# EAGLE design sch (EAGLE 9.5.0)
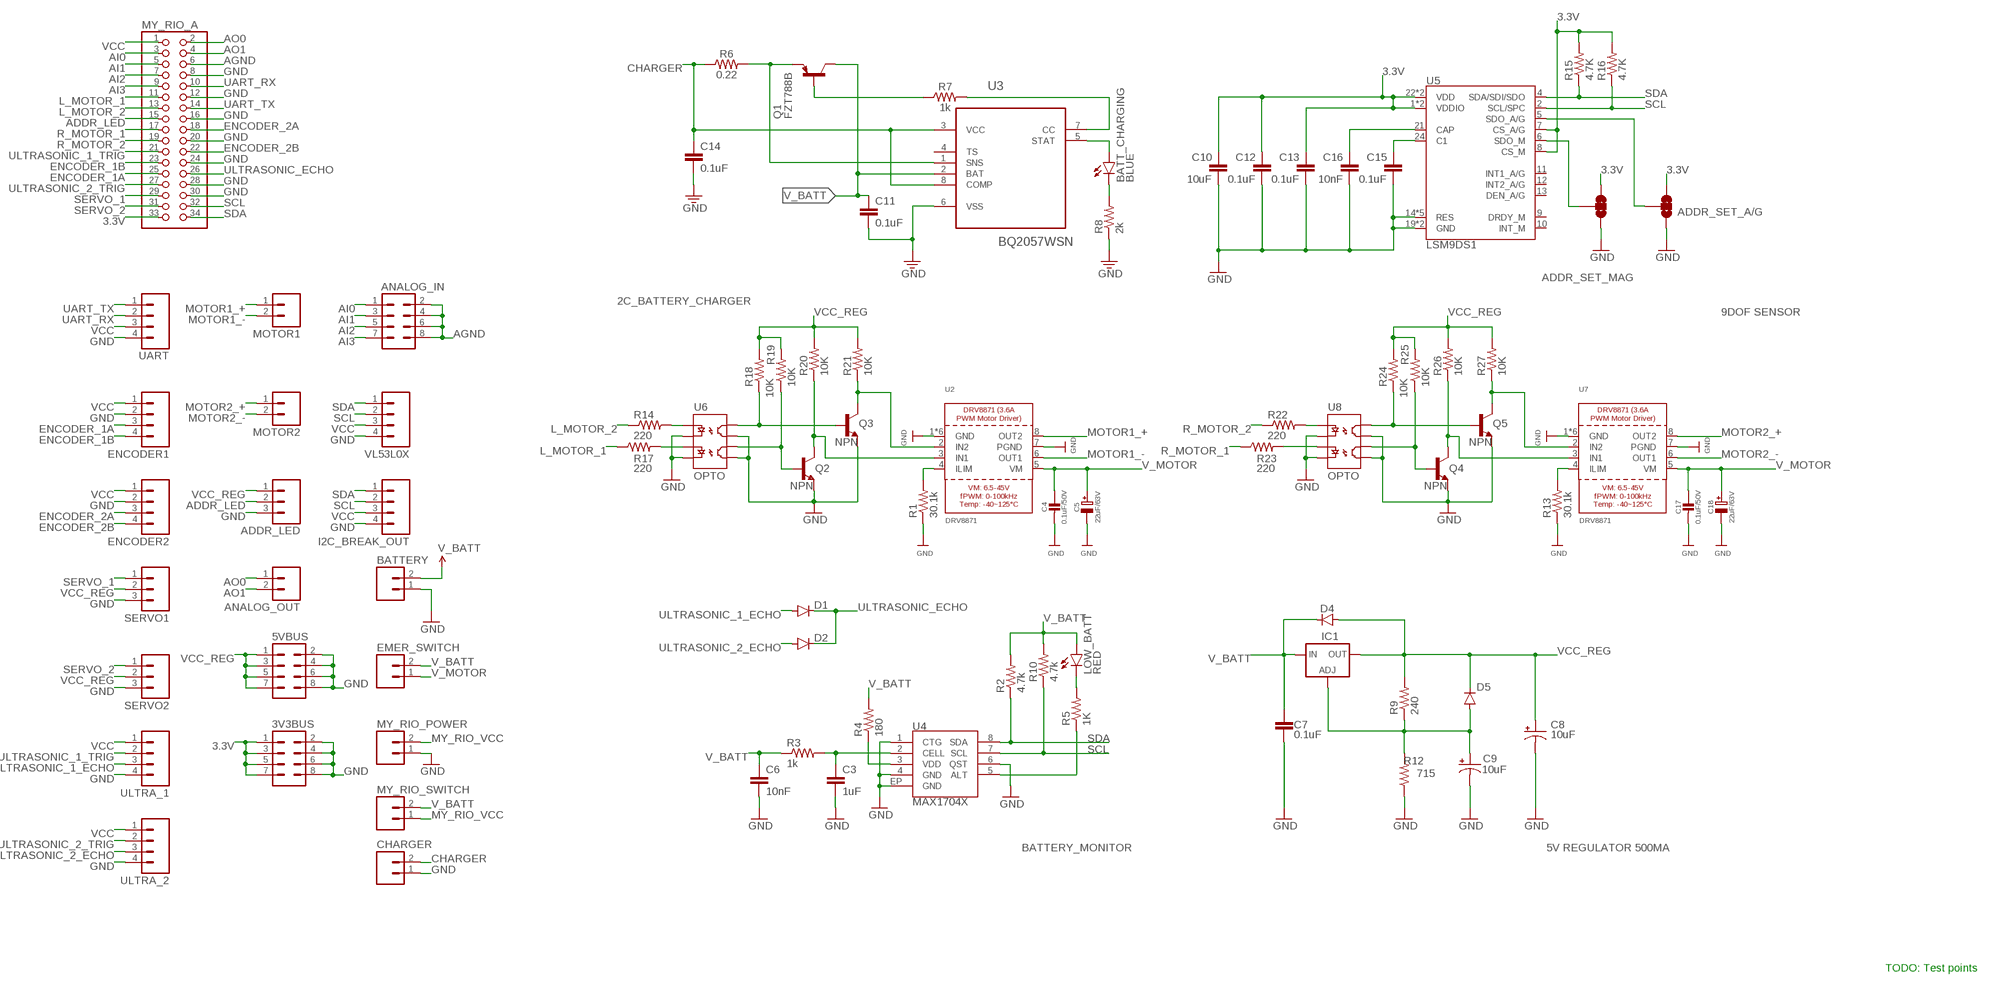
[diagram p0: schematic, sheet 1]

## Parts
3V3BUS  M04X2  [2X4]
5VBUS  M04X2  [2X4]
ADDR_LED  M03POLAR  [MOLEX-1X3]
ADDR_SET_A/G  JUMPER-PAD-3-2OF3_NC_BY_TRACE_SMALL  [PAD-JUMPER-3-2OF3_NC_BY_TRACE_YES_SILK_FULL_BOX]
ADDR_SET_MAG  JUMPER-PAD-3-2OF3_NC_BY_TRACE_SMALL  [PAD-JUMPER-3-2OF3_NC_BY_TRACE_YES_SILK_FULL_BOX]
ANALOG_IN  M04X2  [2X4]
ANALOG_OUT  M021X02_NO_SILK  [1X02_NO_SILK@1]
BATT_CHARGING  BLUE  LED-BLUE0603  [LED-0603]
BATTERY  CONN_02  [1X02]
C3  1uF  CAP0402-CAP  [0402-CAP]
C4  0.1uF/50V  CAP_CERAMIC0805-NOOUTLINE  [0805-NO]
C5  22uF/63V  CAP_ELECTROLYTICPANASONIC_D  [PANASONIC_D]
C6  10nF  CAP0402-CAP  [0402-CAP]
C7  0.1uF  0.1UF-25V(+80/-20%)(0603)  [0603-CAP]
C8  10uF  10UF-16V-10%(TANT)  [EIA3216]
C9  10uF  10UF-16V-10%(TANT)  [EIA3216]
C10  10uF  10UF-6.3V-20%(0603)  [0603-CAP]
C11  0.1uF  0.1UF-0603-25V-(+80/-20%)  [0603]
C12  0.1uF  0.1UF-25V(+80/-20%)(0603)  [0603-CAP]
C13  0.1uF  0.1UF-25V(+80/-20%)(0603)  [0603-CAP]
C14  0.1uF  0.1UF-0603-25V-(+80/-20%)  [0603]
C15  0.1uF  0.1UF-25V(+80/-20%)(0603)  [0603-CAP]
C16  10nF  10NF/10000PF-50V-10%(0603)  [0603-CAP]
C17  0.1uF/50V  CAP_CERAMIC0805-NOOUTLINE  [0805-NO]
C18  22uF/63V  CAP_ELECTROLYTICPANASONIC_D  [PANASONIC_D]
CHARGER  CONN_02  [1X02]
D1  DIODESOD123  [SOD-123]
D2  DIODESOD123  [SOD-123]
D4  1N4002  DIODESOD123  [SOD-123]
D5  1N4002  DIODESOD123  [SOD-123]
EMER_SWITCH  CONN_02  [1X02]
ENCODER1  M041X04_NO_SILK  [1X04_NO_SILK]
ENCODER2  M041X04_NO_SILK  [1X04_NO_SILK]
I2C_BREAK_OUT  M041X04_NO_SILK  [1X04_NO_SILK]
IC1  LM317MBSTT3  [SOT223]
LOW_BATT  RED  LED-RED0603  [LED-0603]
MOTOR1  M02PTH  [1X02@1]
MOTOR2  M02PTH  [1X02@1]
MY_RIO_A  PINHD-2X17  [2X17]
MY_RIO_POWER  CONN_02  [1X02]
MY_RIO_SWITCH  CONN_02  [1X02]
Q1  FZT788B  [SOT230P700X180-4N]
Q2  NPN  TRANSISTOR_NPNSOT23-3  [SOT23-3]
Q3  NPN  TRANSISTOR_NPNSOT23-3  [SOT23-3]
Q4  NPN  TRANSISTOR_NPNSOT23-3  [SOT23-3]
Q5  NPN  TRANSISTOR_NPNSOT23-3  [SOT23-3]
R1  30.1k  30.1KOHM1/10W1%(0603)  [0603-RES]
R2  4.7k  RESISTOR0402-RES  [0402-RES]
R3  1k  RESISTOR0402-RES  [0402-RES]
R4  180  RESISTOR0402-RES  [0402-RES]
R5  1K  1KOHM-1/10W-1%(0603)  [0603-RES]
R6  0.22  0.22OHM-0805-1/4W-1%  [0805@1]
R7  1k  1KOHM-0603-1/10W-1%  [0603]
R8  2k  RESISTOR0603  [0603-RES]
R9  240  240OHM1/10W1%(0603)  [0603-RES]
R10  4.7k  RESISTOR0402-RES  [0402-RES]
R12  715  715OHM1/10W1%(0603)  [0603-RES]
R13  30.1k  30.1KOHM1/10W1%(0603)  [0603-RES]
R14  220  220OHM-1/10W-1%(0603)  [0603-RES]
R15  4.7K  4.7KOHM-1/10W-1%(0603)  [0603-RES]
R16  4.7K  4.7KOHM-1/10W-1%(0603)  [0603-RES]
R17  220  220OHM-1/10W-1%(0603)  [0603-RES]
R18  10K  10KOHM-1/10W-1%(0603)0603  [0603-RES]
R19  10K  10KOHM-1/10W-1%(0603)0603  [0603-RES]
R20  10K  10KOHM-1/10W-1%(0603)0603  [0603-RES]
R21  10K  10KOHM-1/10W-1%(0603)0603  [0603-RES]
R22  220  220OHM-1/10W-1%(0603)  [0603-RES]
R23  220  220OHM-1/10W-1%(0603)  [0603-RES]
R24  10K  10KOHM-1/10W-1%(0603)0603  [0603-RES]
R25  10K  10KOHM-1/10W-1%(0603)0603  [0603-RES]
R26  10K  10KOHM-1/10W-1%(0603)0603  [0603-RES]
R27  10K  10KOHM-1/10W-1%(0603)0603  [0603-RES]
SERVO1  M03POLAR  [MOLEX-1X3]
SERVO2  M03POLAR  [MOLEX-1X3]
U2  DRV8871  [HSOP8]
U3  BQ2057WSN  [SOIC127P600X175-8N]
U4  MAX1704X  [TDFN-8]
U5  LSM9DS1  [LGA24-8X4]
U6  OPTO  OPTOISOLATOR-2SOIC8  [SO08-2]
U7  DRV8871  [HSOP8]
U8  OPTO  OPTOISOLATOR-2SOIC8  [SO08-2]
UART  M04NO_SILK_ALL_ROUND  [1X04_NO_SILK_ALL_ROUND]
ULTRA_1  M041X04_NO_SILK  [1X04_NO_SILK]
ULTRA_2  M041X04_NO_SILK  [1X04_NO_SILK]
VL53L0X  M041X04_NO_SILK  [1X04_NO_SILK]

## Nets
3.3V: 3V3BUS.1 3V3BUS.3 3V3BUS.5 3V3BUS.7 ADDR_SET_A/G.3 ADDR_SET_MAG.3 C10.1 C12.1 C13.1 MY_RIO_A.33 R15.2 R16.2 U5.1(VDDIO) U5.3(VDDIO) U5.7(CS_A/G) U5.8(CS_M) U5.22(VDD) U5.23(VDD)
ADDR_LED [Signal]: ADDR_LED.2 MY_RIO_A.15
AGND [Signal]: ANALOG_IN.2 ANALOG_IN.4 ANALOG_IN.6 ANALOG_IN.8 MY_RIO_A.6
AI0 [Signal]: ANALOG_IN.1 MY_RIO_A.3
AI1 [Signal]: ANALOG_IN.3 MY_RIO_A.5
AI2 [Signal]: ANALOG_IN.5 MY_RIO_A.7
AI3 [Signal]: ANALOG_IN.7 MY_RIO_A.9
ALT [Signal]: R5.1 U4.5(ALT)
AO0 [Signal]: ANALOG_OUT.1 MY_RIO_A.2
AO1 [Signal]: ANALOG_OUT.2 MY_RIO_A.4
BATTERY_MONITOR_2 [Signal]: BATT_CHARGING.A U3.5(STAT)
CHARGER [Signal]: C14.1 CHARGER.2 R6.1 U3.3(VCC) U3.8(COMP)
ENCODER_1A [Signal]: ENCODER1.3 MY_RIO_A.25
ENCODER_1B [Signal]: ENCODER1.4 MY_RIO_A.23
ENCODER_2A [Signal]: ENCODER2.3 MY_RIO_A.18
ENCODER_2B [Signal]: ENCODER2.4 MY_RIO_A.22
GND: 3V3BUS.2 3V3BUS.4 3V3BUS.6 3V3BUS.8 5VBUS.2 5VBUS.4 5VBUS.6 5VBUS.8 ADDR_LED.3 ADDR_SET_A/G.1 ADDR_SET_MAG.1 BATTERY.1 C3.2 C4.2 C5.- C6.2 C7.2 C8.C(-) C9.C(-) C10.2 C11.2 C12.2 C13.2 C14.2 C15.2 C16.2 C17.2 C18.- CHARGER.1 ENCODER1.2 ENCODER2.2 I2C_BREAK_OUT.4 MY_RIO_A.8 MY_RIO_A.12 MY_RIO_A.16 MY_RIO_A.20 MY_RIO_A.24 MY_RIO_A.28 MY_RIO_A.30 MY_RIO_POWER.1 Q2.2(E) Q3.2(E) Q4.2(E) Q5.2(E) R1.1 R8.1 R12.1 R13.1 SERVO1.3 SERVO2.3 U2.1(GND) U2.7(PGND) U2.GND U2.P$1(GND) U2.P$2(GND) U2.P$3(GND) U2.P$4(GND) U3.6(VSS) U4.1(CTG) U4.4(GND) U4.6(QST) U4.EP(GND) U5.14(RES) U5.15(RES) U5.16(RES) U5.17(RES) U5.18(RES) U5.19(GND) U5.20(GND) U6.2(C1) U6.4(C2) U6.5(EM2) U6.7(EM1) U7.1(GND) U7.7(PGND) U7.GND U7.P$1(GND) U7.P$2(GND) U7.P$3(GND) U7.P$4(GND) U8.2(C1) U8.4(C2) U8.5(EM2) U8.7(EM1) UART.4 ULTRA_1.4 ULTRA_2.4 VL53L0X.4
L_MOTOR_1 [Signal]: MY_RIO_A.11 R17.1
L_MOTOR_2 [Signal]: MY_RIO_A.13 R14.1
MOTOR1_+ [Power]: MOTOR1.1 U2.8(OUT2)
MOTOR1_- [Power]: MOTOR1.2 U2.6(OUT1)
MOTOR2_+ [Power]: MOTOR2.1 U7.8(OUT2)
MOTOR2_- [Power]: MOTOR2.2 U7.6(OUT1)
MY_RIO_VCC: MY_RIO_POWER.2 MY_RIO_SWITCH.1
N$1: R1.2 U2.4(ILIM)
N$2 [Signal]: R17.2 U6.3(A2)
N$3: C3.1 R3.2 U4.2(CELL)
N$4 [Signal]: R14.2 U6.1(A1)
N$5: LOW_BATT.C R5.2
N$6: C9.A(+) D5.A IC1.1(ADJ) R9.1 R12.2
N$8: R13.2 U7.4(ILIM)
N$9: C16.1 U5.21(CAP)
N$10 [Signal]: C15.1 U5.24(C1)
N$11: R22.2 U8.1(A1)
N$12: R23.2 U8.3(A2)
N$18 [Power]: Q1.3(E) R6.2 U3.1(SNS)
N$19 [Power]: Q1.1(B) R7.1
N$34: R7.2 U3.7(CC)
N$37: BATT_CHARGING.C R8.2
OUT1 [Signal]: Q3.3(C) R21.1 U2.2(IN2)
OUT1N [Signal]: Q3.1(B) R18.1 U6.8(CL1)
OUT1N1: Q5.1(B) R24.1 U8.8(CL1)
OUT2 [Signal]: Q2.3(C) R20.1 U2.3(IN1)
OUT2N [Signal]: Q2.1(B) R19.1 U6.6(CL2)
OUT2N1: Q4.1(B) R25.1 U8.6(CL2)
OUT3: Q5.3(C) R27.1 U7.2(IN2)
OUT4: Q4.3(C) R26.1 U7.3(IN1)
R_MOTOR_1 [Signal]: MY_RIO_A.17 R23.1
R_MOTOR_2 [Signal]: MY_RIO_A.19 R22.1
SCL [Signal]: I2C_BREAK_OUT.2 MY_RIO_A.32 R10.1 R16.1 U4.7(SCL) U5.2(SCL/SPC) VL53L0X.2
SDA [Signal]: I2C_BREAK_OUT.1 MY_RIO_A.34 R2.1 R15.1 U4.8(SDA) U5.4(SDA/SDI/SDO) VL53L0X.1
SDO_A/G: ADDR_SET_A/G.2 U5.5(SDO_A/G)
SDO_M: ADDR_SET_MAG.2 U5.6(SDO_M)
SERVO_1 [Signal]: MY_RIO_A.29 SERVO1.1
SERVO_2 [Signal]: MY_RIO_A.31 SERVO2.1
UART_RX [Signal]: MY_RIO_A.10 UART.2
UART_TX [Signal]: MY_RIO_A.14 UART.1
ULTRASONIC_1_ECHO: D1.A ULTRA_1.3
ULTRASONIC_1_TRIG [Signal]: MY_RIO_A.21 ULTRA_1.2
ULTRASONIC_2_ECHO: D2.A ULTRA_2.3
ULTRASONIC_2_TRIG [Signal]: MY_RIO_A.27 ULTRA_2.2
ULTRASONIC_ECHO [Signal]: D1.C D2.C MY_RIO_A.26
V_BATT [Power]: BATTERY.2 C6.1 C7.1 C11.1 D4.C EMER_SWITCH.2 IC1.3(IN) LOW_BATT.A MY_RIO_SWITCH.2 Q1.2(C) Q1.4(C) R2.2 R3.1 R4.2 R10.2 U3.2(BAT)
V_MOTOR [Power]: C4.1 C5.+ C17.1 C18.+ EMER_SWITCH.1 U2.5(VM) U7.5(VM)
VCC: ENCODER1.1 ENCODER2.1 I2C_BREAK_OUT.3 MY_RIO_A.1 UART.3 ULTRA_1.1 ULTRA_2.1 VL53L0X.3
VCC_REG: 5VBUS.1 5VBUS.3 5VBUS.5 5VBUS.7 ADDR_LED.1 C8.A(+) D4.A D5.C IC1.4(OUT) R9.2 R18.2 R19.2 R20.2 R21.2 R24.2 R25.2 R26.2 R27.2 SERVO1.2 SERVO2.2
VDD: R4.1 U4.3(VDD)
Unconnected: U3.4(TS) U5.9(DRDY_M) U5.10(INT_M) U5.11(INT1_A/G) U5.12(INT2_A/G) U5.13(DEN_A/G)

## Notes on the sheet
- 2C_BATTERY_CHARGER
- 9DOF SENSOR
- BATTERY_MONITOR | 5V REGULATOR 500MA
- TODO: Test points

## Library data of the parts
3V3BUS 5VBUS ANALOG_IN = SparkFun-Connectors:M04X2: .1" header, two rows of four.
ADDR_LED SERVO1 SERVO2 = SparkFun-Connectors:M03: Header 3 Standard 3-pin 0.1" header. Use with straight break away headers (SKU : PRT-00116), right angle break away headers (PRT-00553), swiss pins (PRT-00743), machine pins (PRT-00117), and female headers (PRT-00115). Molex polarized connector foot print use with SKU : PRT-08232 with associated crimp pins and housings.
ADDR_SET_A/G ADDR_SET_MAG = SparkFun-Passives:JUMPER-PAD-3-2OF3_NC_BY_TRACE
ANALOG_OUT MOTOR1 MOTOR2 = SparkFun-Connectors:M02: Standard 2-pin 0.1" header. Use with - straight break away headers ( PRT-00116) - right angle break away headers (PRT-00553) - swiss pins (PRT-00743) - machine pins (PRT-00117) - female headers (PRT-00115) Molex polarized connector foot print use with: PRT-08233 with associated crimp pins and housings. 2.54_SCREWTERM for use with PRT-10571. 3.5mm Screw Terminal footprints for PRT-08084 5mm Screw Terminal footprints for use with PRT-08432
BATT_CHARGING = SparkFun-LED:LED-BLUE: Blue LEDs for production use Various blue LEDs stocked by SparkFun production 0603 - DIO-08575 Rebel - DIO-09553 1206 - DIO-09911; OC_NEWARK: unknown; PROD_ID: DIO-08575
BATTERY CHARGER EMER_SWITCH MY_RIO_POWER MY_RIO_SWITCH = SparkFun-Connectors:CONN_02: Multi connection point. Often used as Generic Header-pin footprint for 0.1 inch spaced/style header connections On any of the 0.1 inch spaced packages, you can populate with these: Break Away Headers - Straight <https://www.sparkfun.com/products/116> (PRT-00116) Break Away Male Headers - Right Angle <https://www.sparkfun.com/products/553> (PRT-00553) Female Headers <https://www.sparkfun.com/products/115> (PRT-00115) Break Away Headers - Machine Pin <https://www.sparkfun.com/products/117> (PRT-00117) Break Away Female Headers - Swiss Machine Pin <https://www.sparkfun.com/products/743> (PRT-00743) For SCREWTERMINALS and SPRING TERMINALS visit here: Screw Terimnals on SparkFun.com <https://www.sparkfun.com/search/results?term=Screw+Terminals> (5mm/3.5mm/2.54mm spacing) This device is also useful as a general connection point to wire up your design to another part of your project. Our various solder wires solder well into these plated through hole pads. Hook-Up Wire - Assortment (Stranded, 22 AWG) <https://www.sparkfun.com/products/11375> (PRT-11375) Hook-Up Wire - Assortment (Solid Core, 22 AWG) <https://www.sparkfun.com/products/11367> (PRT-11367) View the entire wire category on our website here <https://www.sparkfun.com/categories/141> Special notes: Molex polarized connector foot print use with: PRT-08233 with associated crimp pins and housings. 2.54_SCREWTERM for use with PRT-10571. 3.5mm Screw Terminal footprints for PRT-08084 5mm Screw Terminal footprints for use with PRT-08432
C3 C6 = SparkFun:CAP: Capacitor Standard 0603 ceramic capacitor, and 0.1" leaded capacitor.
C4 C17 = microbuilder:CAP_CERAMIC: Ceramic Capacitors For new designs, use the packages preceded by an '_' character since they are more reliable: The following footprints should be used on most boards: _0402 - Standard footprint for regular board layouts _0603 - Standard footprint for regular board layouts _0805 - Standard footprint for regular board layouts _1206 - Standard footprint for regular board layouts For extremely tight-pitch boards where space is at a premium, the following 'micro-pitch' footprints can be used (smaller pads, no silkscreen outline, etc.): _0402MP - Micro-pitch footprint for very dense/compact boards _0603MP - Micro-pitch footprint for very dense/compact boards _0805MP - Micro-pitch footprint for very dense/compact boards _1206MP - Micro-pitch footprint for very dense/compact boards
C5 C18 = microbuilder:CAP_ELECTROLYTIC: Electrolytic Capacitors SMT PANASONIC_C - Size C Panasonic Electrolytic Aluminum Capacitor 47µF 16V 20% Electrolytic Capacitor [Digikey: PCE3890TR-ND] PANASONIC_D - Size D Panasonic Electrolytic Aluminum Capacitor 100µF 25V 20% Electrolytic Capacitor [Digikey: PCE3898TR-ND] PTH 3.5 mm grid, 8 mm diameter ... 3.5 mm grid, 10 mm diameter ...
C7 C12 C13 C15 = SparkFun-Capacitors:0.1UF-25V(+80/-20%)(0603): CAP-00810 Ceramic Standard decoupling cap; PROD_ID: CAP-00810
C8 C9 = SparkFun-Capacitors:10UF-16V-10%(TANT): CAP-00811 1206/EIA-3216 Tantalum capacitor; PROD_ID: CAP-00811
C10 = SparkFun-Capacitors:10UF-6.3V-20%(0603): CAP-11015; PROD_ID: CAP-11015
C11 C14 = SparkFun-Capacitors:0.1UF: 0.1µF ceramic capacitors A capacitor is a passive two-terminal electrical component used to store electrical energy temporarily in an electric field.; OC_NEWARK: unknown; PROD_ID: CAP-00810
C16 = SparkFun-Capacitors:10NF/10000PF-50V-10%(0603): CAP-00867; PROD_ID: CAP-00867
D1 D2 D4 D5 = SparkFun-DiscreteSemi:DIODE: Diode These are standard reverse protection diodes and small signal diodes. SMA package can handle up to about 1A. SOD-323 can handle about 200mA. What the SOD-323 package when ordering, there are some mfgs out there that are 5-pin packages.
ENCODER1 ENCODER2 I2C_BREAK_OUT UART ULTRA_1 ULTRA_2 VL53L0X = SparkFun-Connectors:M04: Header 4 Standard 4-pin 0.1" header. Use with straight break away headers (SKU : PRT-00116), right angle break away headers (PRT-00553), swiss pins (PRT-00743), machine pins (PRT-00117), and female headers (PRT-00115). Molex polarized connector foot print use with SKU : PRT-08231 with associated crimp pins and housings. 1MM SMD Version SKU: PRT-10208
IC1 = v-reg:LM317?*: 500 mA Adjustable Output Positive Voltage Regulator Source: http://www.onsemi.co.jp .. LM317M-D.PDF; PARTNUMBER: LM317M
LOW_BATT = SparkFun-LED:LED-RED: Assorted Red LEDs LilyPad 1206- DIO-09912 1206- DIO-00809 0603- DIO-00819 "SMART" means more efficient and expensive; PROD_ID: DIO-00819
MY_RIO_A = pinhead:PINHD-2X17: PIN HEADER
Q1 = FZT788B:FZT788B; OC_NEWARK: unknown
Q2-Q5 = SparkFun:TRANSISTOR_NPN: Transistor NPN BJT configuration in SOT23 package. MMBT2222 is the common NPN we use. Double check BCE configuration again layout.
R1 R13 = SparkFun-Resistors:30.1KOHM1/10W1%(0603): RES-08595; PROD_ID: RES-08595
R2-R4 R10 = SparkFun:RESISTOR: Resistor Basic schematic elements and footprints for 0603, 1206, and PTH resistors.
R5 = SparkFun-Resistors:1KOHM-1/10W-1%(0603): RES-07856; PROD_ID: RES-07856
R6 = SparkFun-Resistors:0.22OHM: 0.22Ω resistor A resistor is a passive two-terminal electrical component that implements electrical resistance as a circuit element. Resistors act to reduce current flow, and, at the same time, act to lower voltage levels within circuits. - Wikipedia; OC_NEWARK: unknown; PROD_ID: RES-09883
R7 = SparkFun-Resistors:1KOHM: 1kΩ resistor A resistor is a passive two-terminal electrical component that implements electrical resistance as a circuit element. Resistors act to reduce current flow, and, at the same time, act to lower voltage levels within circuits. - Wikipedia; OC_NEWARK: unknown; PROD_ID: RES-07856
R8 = SparkFun-Resistors:RESISTOR: Resistor Basic schematic elements and footprints for 0603, 1206, and PTH resistors.; OC_NEWARK: unknown
R9 = SparkFun-Resistors:240OHM1/10W1%(0603): RES-07849; PROD_ID: RES-07849
R12 = SparkFun-Resistors:715OHM1/10W1%(0603): RES-07850; PROD_ID: RES-07850
R14 R17 R22 R23 = SparkFun-Resistors:220OHM-1/10W-1%(0603): RES-07861; PROD_ID: RES-07861
R15 R16 = SparkFun-Resistors:4.7KOHM-1/10W-1%(0603): RES-07857; PROD_ID: RES-07857
R18-R21 R24-R27 = SparkFun-Resistors:10KOHM-1/10W-1%(0603): RES-00824; PROD_ID: RES-00824
U2 U7 = microbuilder:DRV8871: DRV8871 - 3.6A PWM Motor Driver
U3 = BQ2057WSN:BQ2057WSN: Charge management IC; AVAILABILITY: Good; DESCRIPTION: Low Dropout Linear 2-cell Li-Ion Charge Controller with AutoCompTM, 8.4V 8-SOIC -20 to 70; MP: BQ2057WSN; OC_NEWARK: unknown; PACKAGE: SOIC-8 Texas Instruments; PRICE: 1.54 USD
U4 = SparkFun:MAX1704X: MAX17043/MAX17044: Battery Fuel Guage (43 is 1cell, 44 is 2cell)
U5 = SparkFun-Sensors:LSM9DS1: LSM9DS1 3D accelerometer, gyroscope & magnetometer The LSM9DS1 is a system-in-package featuring a 3D digital linear acceleration sensor, a 3D digital angular rate sensor, and a 3D digital magnetic sensor. The LSM9DS1 has a linear acceleration full scale of ±2g/±4g/±8/±16 g, a magnetic field full scale of ±4/±8/±12/±16 gauss and an angular rate of ±245/±500/±2000 dps. The LSM9DS1 includes an I2 C serial bus interface supporting standard and fast mode (100 kHz and 400 kHz) and an SPI serial standard interface. Magnetic, accelerometer and gyroscope sensing can be enabled or set in power-down mode separately for smart power management. The LSM9DS1 is available in a plastic land grid array package (LGA) and it is guaranteed to operate over an extended temperature range from -40 °C to +85 °C.; PROD_ID: IC-12536
U6 U8 = SparkFun:OPTOISOLATOR-2: Description: Dual gate opto isolator. Vishay part : ILD213T

## Net classes
0 Small power: width 0.254 mm, drill 0.305 mm, clearance 0.152 mm
1 Power: width 0.762 mm, drill 0.762 mm, clearance 0.254 mm
3 Signal: width 0.152 mm, drill 0.305 mm, clearance 0.152 mm

## Board
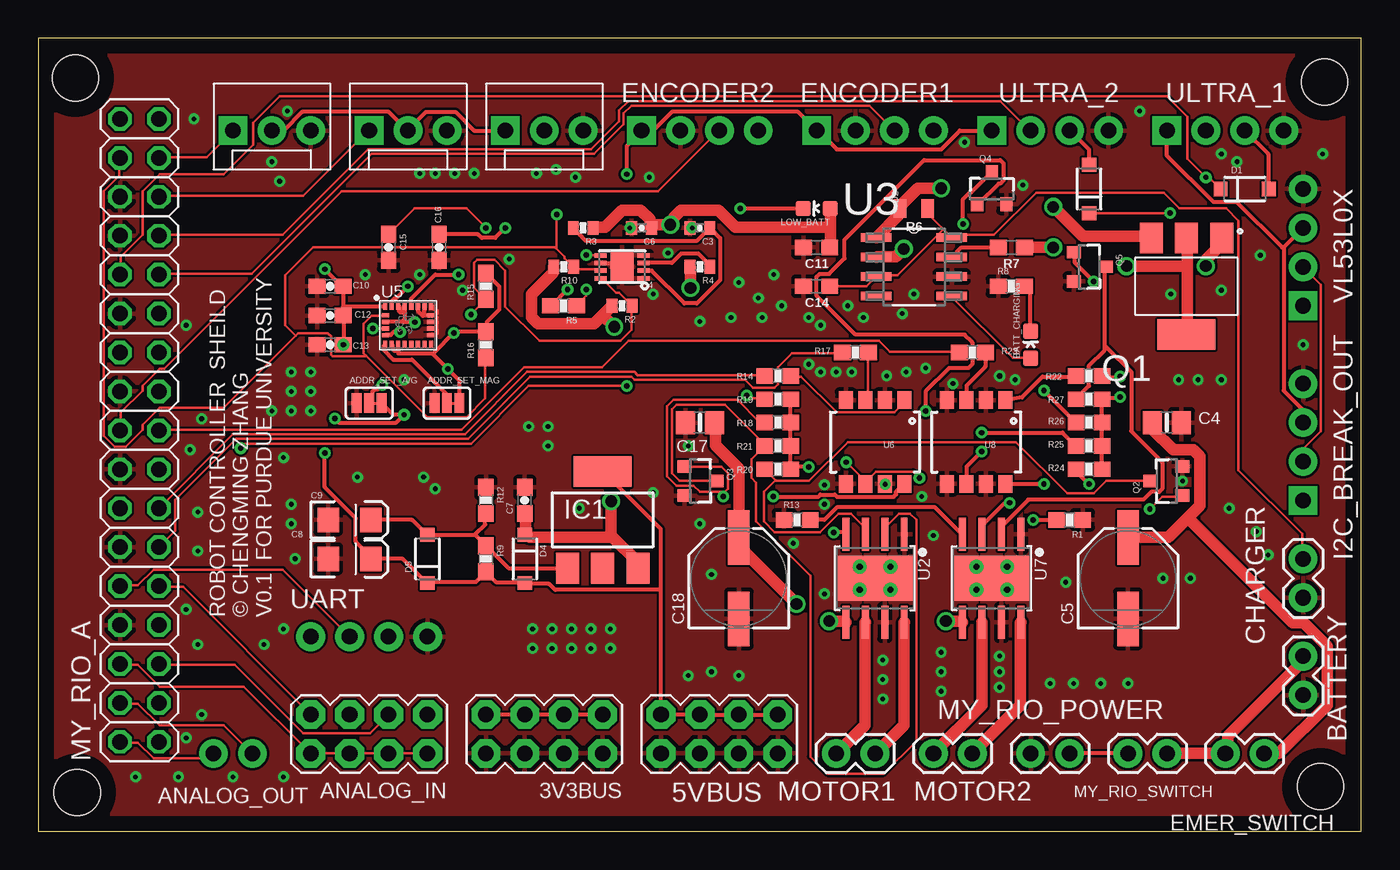
[diagram p1: board, top side]
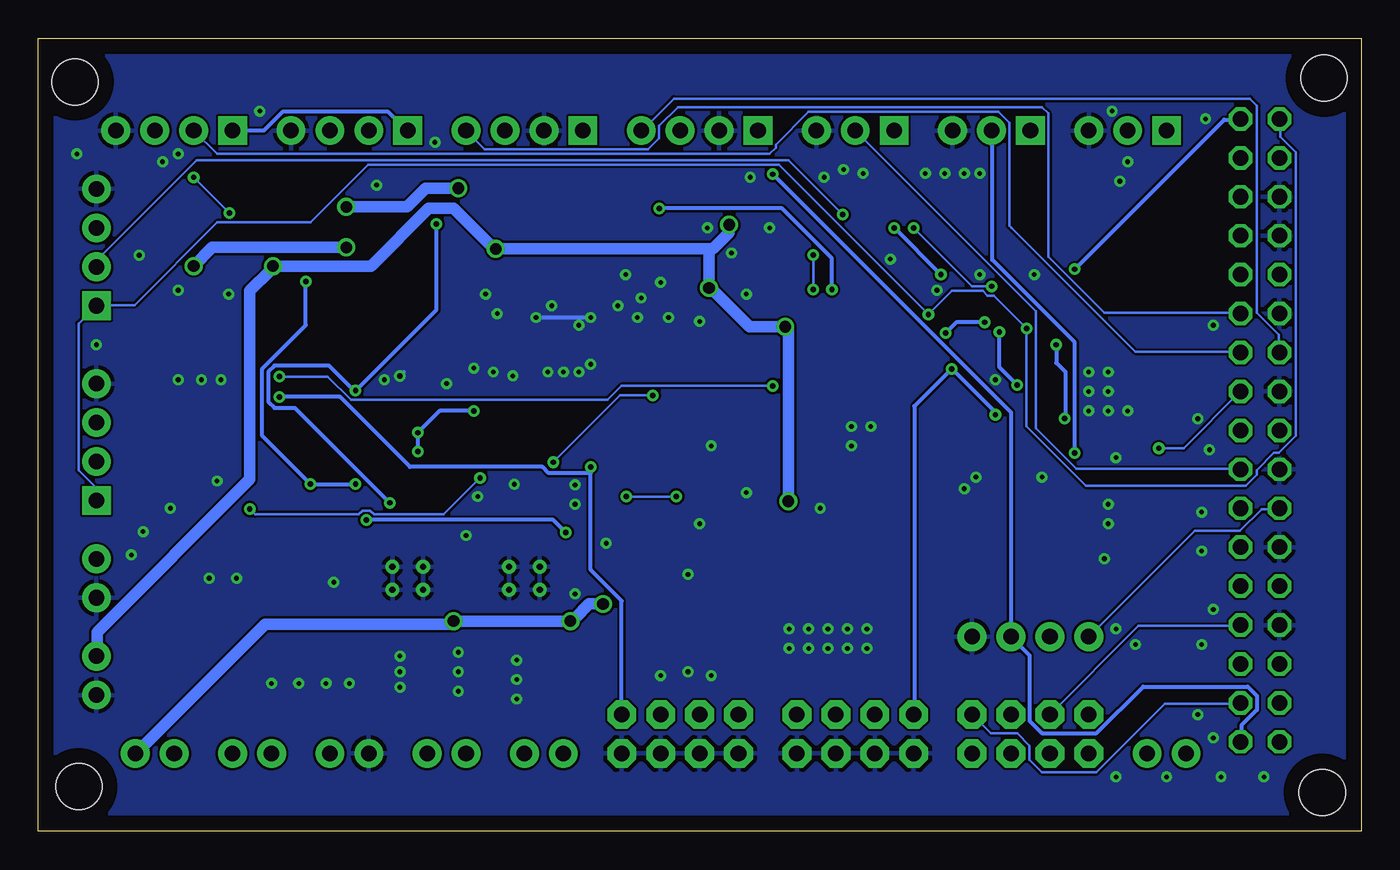
[diagram p2: board, bottom side, seen from below]

Size 86.34 x 51.74 mm. Coordinates in mm from the lower left corner, seen from the top.
Outline: 0,0 86.34,0 86.34,51.74 0,51.74 0,0
Copper layers (1*16): Top 0.035mm / dielectric 1.5mm / Bottom 0.035mm
Design rules "default *": minimum track width 6mil, minimum drill 0.35mm, track to track 6mil, track to pad 6mil, pad to pad 6mil, via to via 6mil, smd to smd 6mil, copper to edge 40mil, drill to drill 6mil, minimum pad ring 10mil, minimum via ring 8mil, stop-mask expansion 4mil, vias tented up to drill 14mil, thermal gap 10mil
Holes 3 mm at 2.41,49.15 2.54,2.54 83.69,2.92 83.95,48.9

### Footprints (pad centres in the part's own frame; a part is rotated, then mirrored left to right if it is on the bottom)
2X4 = drill 1.016 pad 1.88 octagon: 1 -3.81,-1.27; 2 -3.81,1.27; 3 -1.27,-1.27; 4 -1.27,1.27; 5 1.27,-1.27; 6 1.27,1.27; 7 3.81,-1.27; 8 3.81,1.27
MOLEX-1X3 = drill 1.016 pad 1.88 square: 1 0,0 | drill 1.016 pad 1.88: 2 2.54,0; 3 5.08,0
PAD-JUMPER-3-2OF3_NC_BY_TRACE_YES_SILK_FULL_BOX = smd 0.635 x 1.27: 1 -0.813,0; 2 0,0; 3 0.813,0
1X02_NO_SILK@1 = drill 1.016 pad 1.88: 1 0,0; 2 2.54,0
LED-0603 = smd 1 x 1: A 0,-0.877; C 0,0.877
1X02 = drill 1.016 pad 1.88: 1 0,0; 2 2.54,0
0402-CAP = smd 0.7 x 0.9: 1 -0.65,0; 2 0.65,0
0805-NO = smd 1.24 x 1.5: 1 -0.95,0; 2 0.95,0
PANASONIC_D = smd 3.556 x 1.4: + 2.654,0; - -2.654,0
0603-CAP = smd 1.1 x 1: 1 -0.85,0; 2 0.85,0
EIA3216 = smd 1.4 x 1.6: A 1.4,0; C -1.4,0
0603 = smd 1.1 x 1: 1 -0.85,0; 2 0.85,0
SOD-123 = smd 0.9 x 0.95: A 1.575,0; C -1.575,0
1X04_NO_SILK = drill 1.016 pad 1.88 square: 1 0,0 | drill 1.016 pad 1.88: 2 2.54,0; 3 5.08,0; 4 7.62,0
SOT223 = smd 1.5 x 2: 1 -2.3,-3.15; 2 0,-3.15; 3 2.3,-3.15 | smd 3.8 x 2: 4 0,3.15
1X02@1 = drill 1.016 pad 1.88: 1 0,0; 2 2.54,0
2X17 = drill 1.016 octagon: 1 -20.32,-1.27; 2 -20.32,1.27; 3 -17.78,-1.27; 4 -17.78,1.27; 5 -15.24,-1.27; 6 -15.24,1.27; 7 -12.7,-1.27; 8 -12.7,1.27; 9 -10.16,-1.27; 10 -10.16,1.27; 11 -7.62,-1.27; 12 -7.62,1.27; 13 -5.08,-1.27; 14 -5.08,1.27; 15 -2.54,-1.27; 16 -2.54,1.27; 17 0,-1.27; 18 0,1.27; 19 2.54,-1.27; 20 2.54,1.27; 21 5.08,-1.27; 22 5.08,1.27; 23 7.62,-1.27; 24 7.62,1.27; 25 10.16,-1.27; 26 10.16,1.27; 27 12.7,-1.27; 28 12.7,1.27; 29 15.24,-1.27; 30 15.24,1.27; 31 17.78,-1.27; 32 17.78,1.27; 33 20.32,-1.27; 34 20.32,1.27
SOT230P700X180-4N = smd 1.5 x 2: 1 -2.3,-3.15; 2 0,-3.15; 3 2.3,-3.15 | smd 3.8 x 2: 4 0,3.15
SOT23-3 = smd 0.8 x 0.9: 1 -0.95,-1; 2 0.95,-1; 3 0,1.1
0603-RES = smd 1.1 x 1: 1 -0.85,0; 2 0.85,0
0402-RES = smd 0.7 x 0.9: 1 -0.65,0; 2 0.65,0
0805@1 = smd 0.8 x 1.2: 1 -0.9,0; 2 0.9,0
HSOP8 = smd 0.45 x 2.15: 1 -1.905,-2.875; 2 -0.635,-2.875; 3 0.635,-2.875; 4 1.905,-2.875; 5 1.905,2.875; 6 0.635,2.875; 7 -0.635,2.875; 8 -1.905,2.875 | smd 4.9 x 2.95: GND 0,0 | drill 0.4: P$1 -1,0.75; P$2 -1,-0.75; P$3 1,-0.75; P$4 1,0.75
SOIC127P600X175-8N = smd 1.981 x 0.559: 1 -2.464,1.905; 2 -2.464,0.635; 3 -2.464,-0.635; 4 -2.464,-1.905; 5 2.464,-1.905; 6 2.464,-0.635; 7 2.464,0.635; 8 2.464,1.905
TDFN-8 = smd 0.8 x 0.3: 1 -1.4,0.75; 2 -1.4,0.25; 3 -1.4,-0.25; 4 -1.4,-0.75; 5 1.4,-0.75; 6 1.4,-0.25; 7 1.4,0.25; 8 1.4,0.75 | smd 1.5 x 1.88: EP 0,0
LGA24-8X4 = smd 0.27 x 0.45: 1 -1.505,1.225; 6 -1.505,-1.225; 7 -1.075,-1.225; 8 -0.645,-1.225; 9 -0.215,-1.225; 10 0.215,-1.225; 11 0.645,-1.225; 12 1.075,-1.225; 13 1.505,-1.225; 18 1.505,1.225; 19 1.075,1.225; 20 0.645,1.225; 21 0.215,1.225; 22 -0.215,1.225; 23 -0.645,1.225; 24 -1.075,1.225 | smd 0.45 x 0.27: 2 -1.475,0.645; 3 -1.475,0.215; 4 -1.475,-0.215; 5 -1.475,-0.645; 14 1.475,-0.645; 15 1.475,-0.215; 16 1.475,0.215; 17 1.475,0.645
SO08-2 = smd 0.914 x 1.143: 1 -1.905,-2.731; 2 -0.635,-2.731; 3 0.635,-2.731; 4 1.905,-2.731; 5 1.905,2.731; 6 0.635,2.731; 7 -0.635,2.731; 8 -1.905,2.731
1X04_NO_SILK_ALL_ROUND = drill 1.016 pad 1.88: 1 0,0; 2 2.54,0; 3 5.08,0; 4 7.62,0

### Placement (x,y rotation side)
3V3BUS  33.02,6.35 180 top
5VBUS  44.45,6.35 180 top
ADDR_LED  30.48,45.72 0 top
ADDR_SET_A/G  21.59,27.94 0 top
ADDR_SET_MAG  26.67,27.94 0 top
ANALOG_IN  21.59,6.35 180 top
ANALOG_OUT  11.43,5.08 0 top
BATT_CHARGING  64.77,31.75 0 top
BATTERY  82.55,8.89 90 top
C3  43.18,39.37 180 top
C4  73.66,26.67 0 top
C5  71.12,16.51 90 top
C6  39.37,39.37 180 top
C7  31.75,21.59 90 top
C8  20.32,17.78 0 top
C9  20.32,20.32 0 top
C10  19.05,35.56 180 top
C11  50.8,38.1 180 top
C12  19.05,33.66 180 top
C13  19.05,31.75 180 top
C14  50.8,35.56 180 top
C15  22.86,38.1 270 top
C16  26.16,38.1 270 top
C17  43.18,26.67 180 top
C18  45.72,16.51 90 top
CHARGER  82.55,15.24 90 top
D1  78.74,41.91 0 top
D2  68.58,41.91 90 top
D4  31.75,17.78 270 top
D5  25.4,17.78 90 top
EMER_SWITCH  80.01,5.08 180 top
ENCODER1  50.8,45.72 0 top
ENCODER2  39.37,45.72 0 top
I2C_BREAK_OUT  82.55,21.59 90 top
IC1  36.83,20.32 0 top
LOW_BATT  50.8,40.64 90 top
MOTOR1  54.61,5.08 180 top
MOTOR2  60.96,5.08 180 top
MY_RIO_A  6.6,26.16 90 top
MY_RIO_POWER  64.77,5.08 0 top
MY_RIO_SWITCH  71.12,5.08 0 top
Q1  74.93,35.56 180 top
Q2  73.66,22.86 90 top
Q3  43.18,22.86 270 top
Q4  62.23,41.91 0 top
Q5  68.58,36.83 270 top
R1  67.31,20.32 180 top
R2  38.1,34.29 180 top
R3  35.56,39.37 180 top
R4  43.18,36.83 180 top
R5  34.29,34.29 180 top
R6  57.15,40.64 180 top
R7  63.5,38.1 180 top
R8  63.5,35.56 0 top
R9  29.21,17.78 270 top
R10  34.29,36.83 180 top
R12  29.21,21.59 270 top
R13  49.53,20.32 0 top
R14  48.26,29.72 0 top
R15  29.21,35.56 90 top
R16  29.21,31.75 90 top
R17  53.34,31.24 0 top
R18  48.26,26.67 0 top
R19  48.26,28.19 0 top
R20  48.26,23.62 0 top
R21  48.26,25.15 0 top
R22  68.58,29.72 180 top
R23  60.96,31.24 0 top
R24  68.58,23.62 0 top
R25  68.58,25.15 0 top
R26  68.58,26.67 0 top
R27  68.58,28.19 0 top
SERVO1  21.59,45.72 0 top
SERVO2  12.7,45.72 0 top
U2  54.61,16.51 180 top
U3  57.15,36.83 0 top
U4  38.1,36.83 180 top
U5  24.13,33.02 0 top
U6  54.61,25.4 180 top
U7  62.23,16.51 180 top
U8  61.21,25.4 180 top
UART  17.78,12.7 0 top
ULTRA_1  73.66,45.72 0 top
ULTRA_2  62.23,45.72 0 top
VL53L0X  82.55,34.29 90 top

### Tracks (layer width: path | path; a pad name or v marks a point on that pad's centre or on a via)
3.3V  (via drill 0.35)
  Top 0.254: 3V3BUS.7 3V3BUS.5 3V3BUS.3 3V3BUS.1 | R16.2 29.26,32.61 29.26,33.22 30.07,34.04 30.07,35.56 29.26,36.37 R15.2 | U5.8 23.47,31.7 | U5.3 22.66,33.22 U5.3 23.73,33.25 | 23.47,31.9 U5.8 | C13.1 19.91,31.8 19.91,33.63 C12.1 | C12.1 19.91,33.73 19.91,35.56 C10.1 19.81,35.56 v18.69,36.68 | 29.16,32.51 R16.2 | 25.81,31.19 25.81,31.09 v26.72,30.18 27.48,29.41 ADDR_SET_MAG.3 | C12.1 19.9,34.24 U5.1 | U5.1 22.64,34.24 | U5.23 23.55,34.24 | 23.85,34.24 U5.22 | U5.8 23.48,31.36 | 25.81,31.19 23.48,31.19 23.48,31.36 | U5.7 23.12,31.73 23.12,31.46 23.21,31.37 23.48,31.37 23.48,31.36 | 23.55,34.24 23.55,33.96 23.64,33.87 23.76,33.87 23.85,33.96 23.85,34.18 U5.22 | U5.1 22.64,34.26 | 23.55,34.24 23.55,34.29 23.5,34.34 | U5.22 23.91,33.44 23.73,33.25 | 22.61,27.94 22.61,27.74 23.16,27.18 v23.88,27.18 23.37,26.67 19.61,26.67 v19.35,26.92 | 23.73,33.25 24.54,33.25 v24.58,33.22 | R16.2 27.2,32.6 v27.12,32.52 25.81,31.21 25.81,31.19
  Top 0.305: ADDR_SET_A/G.3 22.61,27.94
  Bottom 0.254: v18.69,36.68 8.94,46.43 7.92,46.43 MY_RIO_A.33 | 3V3BUS.7 29.16,7.62 29.16,27.74 v26.72,30.18 23.88,27.33 v23.88,27.18 | v24.58,33.22 26.42,33.22 v27.12,32.52 | C13.1 19.9,30.57 19.3,29.97 19.3,26.97 v19.35,26.92
  other vias: 19.9,31.75
ADDR_LED
  Bottom 0.152: ADDR_LED.2 21.23,33.93 21.23,26.31 18.59,23.67 7.92,23.67 MY_RIO_A.15
AGND
  Top 0.152: MY_RIO_A.6 5.38,10.87 6.5,10.87 7.92,9.45 13.41,9.45 ANALOG_IN.8 ANALOG_IN.6 ANALOG_IN.4 ANALOG_IN.2
AI0
  Bottom 0.152: ANALOG_IN.1 24.18,6.4 22.45,6.4 21.64,5.59 21.64,4.67 20.83,3.86 17.27,3.86 12.8,8.33 7.92,8.33 MY_RIO_A.3
AI1
  Top 0.152: ANALOG_IN.3 21.64,6.4 17.27,6.4 12.8,10.87 7.92,10.87 MY_RIO_A.5
AI2
  Bottom 0.152: ANALOG_IN.5 14.53,13.41 7.92,13.41 MY_RIO_A.7
AI3
  Top 0.152: ANALOG_IN.7 9.45,15.95 7.92,15.95 MY_RIO_A.9
ALT  (via drill 0.35)
  Top 0.152: v35.76,37.59 36.68,37.59 U4.5 | v35.76,35.36 35.76,34.95 35.15,34.34 R5.1
  Bottom 0.152: v35.76,35.36 v35.76,37.59
AO0
  Top 0.152: MY_RIO_A.2 5.38,5.79 6.5,5.79 7.52,4.78 11.07,4.78 11.38,5.08 ANALOG_OUT.1
AO1
  Top 0.152: MY_RIO_A.4 5.38,8.33 6.5,8.33 7.92,6.91 12.09,6.91 13.92,5.08 ANALOG_OUT.2
BATTERY_MONITOR_2
  Top 0.152: BATT_CHARGING.A 64.72,30.89 63.6,30.89 59.64,34.85 U3.5
CHARGER
  Top 0.152: 59.08,39.27 U3.8 59.54,38.91 62.38,38.91 65.13,41.66 73.46,41.66 74.47,40.64 77.52,40.64 78.33,39.83 78.33,23.57 82.5,19.41 82.5,17.78 CHARGER.2 | 59.08,39.27 58.12,40.23 58.12,40.64 R6.1 | C14.1 54.05,35.56 U3.3 54.76,36.27 56.08,36.27 59.08,39.27
ENCODER_1A
  Top 0.152: ENCODER1.3 54.25,47.35 38.71,47.35 38.2,46.84 38.2,46.13 36.27,44.2 21.74,44.2 13.92,36.37 7.92,36.37 MY_RIO_A.25
ENCODER_1B
  Bottom 0.152: ENCODER1.4 57.2,44.5 46.53,44.5 45.82,45.21 45.82,46.02 44.6,47.24 20.83,47.24 20.42,46.84 20.42,37.49 16.76,33.83 7.92,33.83 MY_RIO_A.23
ENCODER_2A
  Top 0.152: MY_RIO_A.18 5.38,26.21 5.38,27.33 6.81,28.75 6.81,29.06 7.92,30.18 8.23,30.18 19.81,41.76 40.44,41.76 44.4,45.72 ENCODER2.3
ENCODER_2B
  Bottom 0.152: MY_RIO_A.22 5.38,31.29 5.38,32.41 6.81,33.83 6.81,47.35 7.26,47.8 44.86,47.8 46.94,45.72 ENCODER2.4
GND  (via drill 0.3, 0.35)
  Top 0.254: 26.01,32.72 26.01,32.51 25.91,32.41 25.7,32.41 U5.14 | 26.01,32.72 25.91,32.82 25.7,32.82 U5.15 | 25.91,33.22 25.7,33.22 U5.16 | 25.91,33.22 26.01,33.12 26.01,32.72 | 25.91,33.63 25.7,33.63 U5.17 25.5,33.63 25.09,33.63 | 25.91,33.63 26.01,33.53 26.01,33.22 25.91,33.22 | 25.09,33.63 24.79,33.93 24.79,34.24 U5.20 24.79,34.34 | 25.2,34.34 U5.19 25.2,33.97 25.18,33.94 25.18,33.82 25.2,33.79 25.2,33.74 25.09,33.63 | 25.91,33.63 25.91,33.73 26.01,33.83 26.01,33.93 25.7,34.24 U5.18 | U4.6 37.85,37.08 U4.EP
  Bottom 0.254: v53.85,33.53 v50.29,33.53 | 62.48,29.97 v62.74,29.72
  other vias: 16.51,28.7 16.51,29.97 16.51,27.43 17.78,27.43 17.78,28.7 17.78,29.97 15.24,27.43 16,24.38 16.51,21.34 16.51,20.07 16.76,17.78 10.41,20.83 10.41,18.29 16,13.21 14.73,12.19 10.41,12.19 9.65,14.48 10.67,7.62 9.65,6.1 9.14,3.56 6.35,3.56 12.7,3.56 16,3.56 9.91,24.89 10.67,26.92 9.65,33.02 15.24,43.69 15.75,42.42 10.16,46.48 39.88,42.67 16.26,46.99 40.13,35.05 30.73,37.34 27.69,35.31 25.15,23.11 25.91,22.35 20.83,23.11 32,26.42 33.27,26.42 33.27,25.15 35.31,21.08 42.42,10.16 43.94,10.41 45.72,10.16 40.13,22.1 43.18,20.07 37.34,13.21 36.07,13.21 34.8,13.21 33.53,13.21 32.26,13.21 32.26,11.94 33.53,11.94 34.8,11.94 36.07,11.94 37.34,11.94 43.94,16.76 58.93,10.41 58.42,19.3 58.93,11.68 58.93,9.14 67.06,16.26 66.04,9.65 67.56,9.65 69.34,9.65 71.12,9.65 73.41,16.51 75.18,16.51 74.42,29.46 75.69,29.46 77.22,29.46 82.55,31.75 71.88,46.99 78.23,43.69 77.22,44.2 83.82,44.2 79.76,37.59 77.22,35.31 73.91,35.05 79.5,19.56 80.26,18.03 77.72,21.08 57.66,21.84 51.31,22.61 49.28,18.8 51.31,15.49 51.31,21.34 21.34,36.32 24.89,36.32 32.51,42.93 33.78,43.18 35.05,42.67 28.45,42.93 27.18,42.93 25.91,42.93 24.89,42.93 23.88,29.46 38.61,39.37 42.67,39.37 42.42,25.15 55.27,22.64 41.1,37.74 62.74,11.43 62.74,10.41 62.74,9.4 55.12,11.18 55.12,9.91 55.12,8.64 74.68,22.86 64.26,42.16 60.45,44.96 51.05,33.02 52.83,34.29 47.24,33.53 56.39,33.78 57.15,35.05 46.99,34.8 45.21,33.53 45.72,35.81 43.18,33.27 48.01,36.32 48.51,34.29 59.69,29.21 56.64,29.97 57.91,30.23 55.37,29.72 53.09,29.97 52.07,29.97 51.05,29.97 50.29,30.48 63.75,29.46
  pour Top: 0,52.07 0,0 86.36,0 86.36,52.07
  pour Bottom: 0,52.07 0,0 86.36,0 86.36,52.07
L_MOTOR_1
  Top 0.152: MY_RIO_A.11 8.94,19.61 8.94,21.64 12.9,25.6 28.04,25.6 32.11,29.67 38.71,29.67 38.91,29.46 46.13,29.46 46.63,28.96 48.06,28.96 48.26,29.16 48.26,30.28 49.17,31.19 52.43,31.19 R17.1
L_MOTOR_2
  Top 0.152: MY_RIO_A.13 12.7,25.91 27.84,25.91 31.9,29.97 38.91,29.97 39.12,29.77 47.35,29.77 R14.1
MOTOR1_+
  Top 0.762: U2.8 56.49,13.61 56.49,6.91 54.66,5.08 MOTOR1.1
MOTOR1_-
  Top 0.762: U2.6 53.95,13.61 53.95,6.91 52.12,5.08 MOTOR1.2
MOTOR2_+
  Top 0.762: MOTOR2.1 64.11,8.23 64.11,13.61 U7.8
MOTOR2_-
  Top 0.762: MOTOR2.2 61.57,8.23 61.57,13.61 U7.6
MY_RIO_VCC
  Top 0.254: MY_RIO_SWITCH.1 MY_RIO_POWER.2
N$1  (via drill 0.35)
  Top 0.254: v64.92,20.32 R1.2 | v51.92,19.51 52.53,19.51 52.63,19.41 U2.4
  Bottom 0.254: v64.92,20.32 52.73,20.32 v51.92,19.51
N$2
  Top 0.152: R17.2 54.15,31.19 54.15,28.25 54.05,28.14 U6.3
N$3
  Top 0.254: U4.2 39.52,36.58 40.03,36.58 42.16,34.44 42.98,34.44 44.5,35.97 44.5,38.71 43.89,39.32 C3.1 | R3.2 34.95,39.32 35.36,38.91 35.46,38.81 35.48,38.79 35.48,38.76 35.7,38.54 43,38.54 C3.1 | 43.79,39.32 C3.1
N$4
  Top 0.152: R14.2 49.17,29.67 49.78,29.67 52.12,27.33 55.88,27.33 56.59,28.04 U6.1
N$5  (via drill 0.35)
  Top 0.254: v45.82,40.64 LOW_BATT.C | v34.54,35.36 33.53,34.34 R5.2
  Bottom 0.254: v45.82,40.64 37.8,40.64 34.54,37.39 v34.54,35.36
N$6
  Top 0.254: 28.55,19.3 25.4,19.3 D5.A 25.3,19.41 24.38,20.32 C9.A | 28.55,19.3 29.16,18.69 R9.1 29.26,18.59 30.68,17.17 34.44,17.17 IC1.1 | R12.2 29.16,20.73 29.16,20.02 28.55,19.41 28.55,19.3
N$8
  Top 0.254: R13.2 51.31,20.32 52.12,21.13 58.52,21.13 60.25,19.41 U7.4
N$9  (via drill 0.35)
  Top 0.254: C16.1 28.7,38.95 28.94,38.71 29.82,38.71 v30.48,39.37 | U5.21 24.34,34.76 25.91,36.32 v27.43,36.32
  Bottom 0.254: v27.43,36.32 v30.48,39.37
N$10  (via drill 0.35)
  Top 0.152: C15.1 24.55,40.64 27.94,40.64 v29.21,39.37 | 23,34.3 U5.24
  Top 0.254: v24.13,35.56 23.32,34.75 23.23,34.75 23.05,34.57 U5.24
  Bottom 0.152: v29.21,39.37 25.4,35.56 v24.13,35.56
N$11
  Top 0.254: R22.2 67.67,29.67 65.53,29.67 64.21,28.35 64.21,28.31 U8.1
N$12
  Top 0.254: 61.77,31.19 R23.2 61.81,30.31 60.58,29.08 U8.3
N$18  (via drill 0.76)
  Top 0.762: U3.1 56.19,40.23 56.19,40.64 R6.2 56.39,40.95 57.4,41.96 v58.93,41.96 | v66.24,40.74 68.17,38.81 72.54,38.81 Q1.3
  Bottom 0.762: v66.24,40.74 62.28,40.74 61.06,41.96 v58.93,41.96
N$19  (via drill 0.76)
  Top 0.762: v66.24,38.1 R7.1 | v76.2,36.88 76.2,37.29 77.22,38.3 77.22,38.71 Q1.1
  Bottom 0.762: v66.24,38.1 74.98,38.1 v76.2,36.88
N$34
  Top 0.254: R7.2 60.25,38.1 U3.7
N$37
  Top 0.254: BATT_CHARGING.C 64.72,32.72 64.72,35.26 64.41,35.56 R8.2
OUT1
  Top 0.152: Q3.3 41.86,22.86 41.35,23.37 41.35,27.53 41.66,27.84 44.81,27.84 47.45,25.2 R21.1 47.35,25.09 46.53,24.28 46.53,23.06 46.84,22.76 46.84,20.22 50.39,16.66 50.39,4.88 51.51,3.76 55.17,3.76 57.3,5.89 57.3,20.32 56.9,20.73 56.19,20.73 55.27,19.81 55.27,19.41 U2.2
OUT1N  (via drill 0.35)
  Top 0.152: 44.7,22.15 43.18,22.15 42.77,22.55 41.66,22.55 41.05,23.16 41.05,27.74 41.45,28.14 45.62,28.14 47.04,26.72 47.35,26.72 R18.1 | 44.7,22.15 44.81,22.15 45.01,22.35 45.01,23.37 44.6,23.77 42.27,23.77 Q3.1 | 55.98,22.15 55.98,22.05 55.78,21.84 | 44.7,22.15 v44.7,21.84 | 56.49,22.66 U6.8
  Top 0.254: v47.95,21.84 50.92,21.84 51.05,21.97 51.98,21.97 52.13,21.82 55.82,21.82 55.98,21.98 55.98,22.15 56.49,22.66
  Bottom 0.152: v44.7,21.84 v47.95,21.84
OUT1N1  (via drill 0.35)
  Top 0.254: v68.89,35.87 67.67,37.08 67.67,37.69 Q5.1 | v68.58,22.66 67.67,23.57 R24.1 | v65.63,22.66 63.2,22.66 U8.8
  Bottom 0.254: v68.89,35.87 68.89,33.02 71.73,30.18 71.73,25.81 v68.58,22.66 v65.63,22.66
OUT2
  Top 0.152: Q2.3 69.7,22.86 68.89,22.05 67.16,22.05 63.8,25.4 52.83,25.4 50.29,22.86 48.16,22.86 48.11,22.91 | 48.11,22.91 47.45,23.57 R20.1 | 48.11,22.91 47.35,22.15 47.35,20.22 48.06,19.51 51,19.51 52.22,20.73 53.03,20.73 53.95,19.81 53.95,19.41 U2.3
OUT2N  (via drill 0.35)
  Top 0.152: v72.54,21.03 73.36,21.84 74.57,21.84 Q2.1 | v57.51,23.06 57.1,23.47 54.66,23.47 53.95,22.76 U6.6 53.95,22.86 v52.73,24.08 | v46.23,28.45 46.43,28.25 47.35,28.25 R19.1
  Bottom 0.152: v46.23,28.45 48.36,28.45 v52.73,24.08 | v72.54,21.03 72.19,20.68 65.42,20.68 65.17,20.93 64.67,20.93 64.42,20.68 59.89,20.68 v57.51,23.06
OUT2N1  (via drill 0.35)
  Top 0.254: Q4.1 61.37,40.95 62.69,42.27 62.79,42.27 62.99,42.47 62.99,43.59 62.79,43.79 57.81,43.79 52.63,38.61 52.63,37.39 51.61,36.37 51,36.37 50.8,36.17 50.8,34.95 53.34,32.41 60.45,32.41 60.96,31.9 60.96,30.48 60.71,30.23 59.44,30.23 57.91,28.7 v57.91,27.43 | R25.1 67.67,25.2 66.85,26.01 v61.57,26.01 | v61.57,24.79 60.58,23.8 U8.6
  Bottom 0.254: v61.57,24.79 v61.57,26.01 60.15,27.43 v57.91,27.43
OUT3
  Top 0.254: 69.6,31.6 69.6,31.39 68.58,30.38 68.58,29.06 67.77,28.25 R27.1 | 69.6,31.6 69.6,36.78 Q5.3 | U7.2 62.89,19.41 62.89,19.91 64.62,21.64 72.14,21.64 72.64,22.15 73.15,22.15 73.36,22.35 73.36,24.08 71.32,26.11 71.32,29.97 69.7,31.6 69.6,31.6
OUT4  (via drill 0.35)
  Top 0.254: v60.35,39.62 60.35,41.25 60.76,41.66 60.86,41.66 62.18,42.98 Q4.3 | v65.63,28.75 67.67,26.72 R26.1 | 61.67,19.7 61.67,19.41 U7.3 61.59,19.94 63.09,21.43 v63.41,21.43
  Bottom 0.254: v60.35,39.62 60.35,34.04 v65.63,28.75 65.73,28.75 67.36,30.38 70.92,30.38 71.32,29.97 71.32,28.04 70.92,27.64 69.6,27.64 v63.41,21.45 v63.41,21.43
R_MOTOR_1
  Top 0.152: R23.1 60.05,31.29 55.58,31.29 54.86,32 38.51,32 36.78,30.28 31.7,30.28 27.64,26.21 7.92,26.21 MY_RIO_A.17
R_MOTOR_2  (via drill 0.35)
  Top 0.152: v70.61,29.67 69.49,29.67 R22.1 | v38.41,29.06 32,29.06 28.25,25.3 13.51,25.3 v13.21,24.99
  Bottom 0.152: v70.61,29.67 67.46,29.67 65.94,28.14 49.17,28.14 48.26,29.06 v38.41,29.06 | v13.21,24.99 11.58,24.99 MY_RIO_A.19
SCL  (via drill 0.35)
  Top 0.152: VL53L0X.2 83.72,35.66 83.72,26.11 82.6,24.99 82.6,24.18 I2C_BREAK_OUT.2 | U4.7 36.68,36.68 35.05,36.68 34.95,36.78 R10.1 34.85,36.88 34.34,37.39 34.34,37.49 33.78,38.05 | 21.39,31.04 25.4,27.03 27.94,27.03 29.16,28.25 29.16,30.89 R16.1 | 21.39,31.04 21.23,31.19 21.23,33.12 21.74,33.63 22.55,33.63 U5.2 | 33.78,38.05 33.73,38.1 17.93,38.1 16.1,36.27 16.1,33.02 16.79,32.33 | 21.39,31.04 21.34,30.99 19.2,30.99 19.1,31.09 19.1,32.31 18.9,32.51 16.97,32.51 16.79,32.33 | 16.79,32.33 12.09,27.64 7.92,27.64 6.81,26.52 6.81,26.21 5.69,25.09 4.98,25.09 4.27,25.81 4.27,41.76 5.28,42.77 5.28,43.89 MY_RIO_A.32 | v33.83,40.23 33.83,38.1 33.78,38.05
  Bottom 0.152: v33.83,40.23 37.39,43.79 76,43.79 82.5,37.29 82.5,36.88 VL53L0X.2
SDA  (via drill 0.35)
  Top 0.152: U4.8 36.78,36.07 37.69,35.15 37.9,35.15 38.71,34.34 R2.1 38.71,34.24 38.71,32.72 38,32 32.72,32 30.48,34.24 30.48,36.58 29.77,37.29 28.65,37.29 28.45,37.08 28.45,35.46 29.16,34.75 R15.1 29.16,34.65 v28.25,33.73 | v21.84,32.82 22.55,32.82 U5.4
  Bottom 0.152: I2C_BREAK_OUT.1 82.6,21.64 82.6,22.45 83.72,23.57 83.72,33.12 VL53L0X.1 82.5,34.34 80.06,34.34 74.68,39.73 68.58,39.73 64.82,43.48 38,43.48 v28.25,33.73 26.72,35.26 24.68,35.26 24.38,34.95 23.98,34.95 v21.84,32.82 21.84,26.42 17.98,22.55 7.52,22.55 6.81,23.27 6.81,23.57 5.69,24.69 5.38,24.69 4.27,25.81 4.27,44.3 5.28,45.31 5.28,46.43 MY_RIO_A.34
SDO_A/G  (via drill 0.35)
  Top 0.254: ADDR_SET_A/G.2 21.81,28.16 21.81,28.69 21.97,28.85 22.19,28.85 v22.45,29.12 | U5.5 22.67,32.39 23,32.39 23.19,32.59 v23.61,32.59
  Bottom 0.254: v22.45,29.12 23.61,30.28 v23.61,32.59
SDO_M
  Top 0.254: 26.62,28.55 26.62,27.94 | U5.6 22.55,31.7 22.55,31.39 23.16,30.79 24.38,30.79 26.62,28.55 | ADDR_SET_MAG.2 26.67,28.5 26.62,28.55
SERVO_1
  Top 0.152: MY_RIO_A.29 7.92,41.45 17.27,41.45 21.54,45.72 SERVO1.1
SERVO_2
  Top 0.152: SERVO2.1 10.97,43.99 7.92,43.99 MY_RIO_A.31
UART_RX
  Top 0.152: UART.2 15.95,17.07 7.52,17.07 6.5,16.05 5.38,16.05 MY_RIO_A.10
UART_TX
  Bottom 0.152: UART.1 10.87,19.61 7.92,19.61 6.5,21.03 5.38,21.03 MY_RIO_A.14
ULTRASONIC_1_ECHO
  Top 0.254: ULTRA_1.3 80.26,44.2 80.26,41.96 D1.A
ULTRASONIC_1_TRIG
  Bottom 0.152: ULTRA_1.2 74.68,44.2 38.61,44.2 38.2,44.6 38.2,44.81 36.07,46.94 23.67,46.94 22.96,46.23 22.96,39.52 22.84,39.4 14.73,31.29 7.92,31.29 MY_RIO_A.21
ULTRASONIC_2_ECHO
  Top 0.254: D2.A 68.58,44.5 67.36,45.72 ULTRA_2.3
ULTRASONIC_2_TRIG
  Top 0.152: MY_RIO_A.27 7.92,38.91 15.95,38.91 21.54,44.5 36.07,44.5 37.9,46.33 37.9,47.04 38.51,47.65 62.79,47.65 64.72,45.72 ULTRA_2.2
ULTRASONIC_ECHO  (via drill 0.35)
  Top 0.152: v73.86,40.34 D2.C | D2.C | D1.C 77.11,41.96 76.4,42.67 v76.2,42.67 74.98,43.89 74.98,46.63 73.66,47.95 15.75,47.95 14.02,46.23 14.02,44.81 12.09,42.88 7.92,42.88 6.81,41.76 6.81,38.91 5.38,37.49 5.38,36.37 MY_RIO_A.26
  Bottom 0.152: v76.2,42.67 v73.86,40.34
V_BATT  (via drill 0.76)
  Top 0.762: MY_RIO_SWITCH.2 EMER_SWITCH.2 77.62,5.38 77.62,6.2 82.5,11.07 82.5,11.38 BATTERY.2 | 74.98,36.88 74.98,32.41 Q1.4 | 74.98,36.88 74.98,38.71 Q1.2 | C7.1 31.8,20.73 31.8,19.41 D4.C 32.11,19.2 37.39,19.2 | 37.39,19.2 37.49,19.2 39.12,17.58 39.12,17.17 IC1.3 | 36.83,33.68 37.39,34.24 R2.2 | 36.83,33.68 36.27,33.12 32.61,33.12 32.21,33.53 32.21,35.05 33.63,36.47 33.63,36.78 R10.2 | 51.71,39.42 51.71,38.1 C11.1 | 51.71,39.42 51.71,40.64 LOW_BATT.A | R3.1 36.27,39.42 36.98,39.42 38.1,40.54 39.32,40.54 39.93,39.93 39.93,39.42 C6.1 40.22,39.57 v41.25,39.57 41.45,39.88 41.45,40.03 41.96,40.54 44.4,40.54 45.52,39.42 51.71,39.42 | v42.57,35.46 42.57,36.78 R4.2 | v56.49,38 55.98,37.49 54.76,37.49 U3.2 | v37.59,32.92 36.83,33.68 | v37.39,21.54 37.39,19.2 | v71.02,36.88 74.98,36.88
  Bottom 0.762: 42.57,38 v42.57,35.46 42.27,35.26 39.93,32.92 v37.59,32.92 37.39,32.61 v37.39,21.54 | v41.25,39.57 41.25,39.06 42.32,38 42.57,38 | 42.57,38 42.82,38 v56.49,38 56.79,38.2 59.23,40.64 60.86,40.64 64.62,36.88 v71.02,36.88 71.22,36.58 72.54,35.26 72.54,22.96 82.5,13.01 82.5,11.48 BATTERY.2
V_MOTOR  (via drill 0.76)
  Top 0.762: C17.1 44.2,26.62 44.2,25.2 45.72,23.67 C18.+ 45.82,18.8 45.82,18.49 v49.48,14.83 | v51.61,13.72 52.63,13.72 U2.5 | v59.23,13.72 60.25,13.72 U7.5 | 75.03,20.47 73.76,19.2 71.12,19.2 C5.+ | 75.03,20.47 75.79,21.23 75.79,24.49 75.39,24.89 74.07,24.89 72.75,26.21 72.75,26.62 C4.1 | EMER_SWITCH.1 80.97,5.08 84.12,8.23 84.12,12.09 82.6,13.61 81.89,13.61 75.03,20.47
  Bottom 0.762: EMER_SWITCH.1 79.96,5.08 71.53,13.51 59.54,13.51 v59.23,13.72 v51.61,13.72 51.31,13.92 50.39,14.83 v49.48,14.83
VCC  (via drill 0.35)
  Top 0.254: 81.28,38.1 81.28,28.75 82.5,27.53 82.5,26.72 I2C_BREAK_OUT.3 | VL53L0X.3 81.28,38.1 | ULTRA_1.1 73.66,44.09 76.71,41.05 78.23,41.05 81.18,38.1 81.28,38.1 | ULTRA_2.1 60.15,45.72 58.93,44.5 52.12,44.5 50.9,45.72 ENCODER1.1 49.58,46.94 41.35,46.94 40.13,45.72 ENCODER2.1 39.32,45.62 38.41,44.7 v38.41,42.88
  Bottom 0.254: MY_RIO_A.1 7.82,5.89 7.82,6.91 6.81,7.92 6.81,8.84 7.42,9.45 14.22,9.45 17.27,6.4 20.83,6.4 21.64,7.21 21.64,11.48 UART.3 22.86,27.33 v38.41,42.88 | ULTRA_1.1 71.63,45.72 70.41,46.94 63.5,46.94 62.28,45.72 ULTRA_2.1
VCC_REG  (via drill 0.35)
  Top 0.254: R24.2 69.39,23.67 69.39,25.09 R25.2 69.39,25.2 69.39,26.62 R26.2 69.39,26.72 69.39,28.14 R27.2 69.49,28.25 70.51,28.25 v70.61,28.35 | R19.2 49.07,28.14 49.07,26.72 R18.2 49.07,26.62 49.07,25.2 R21.2 49.07,25.09 49.07,23.67 R20.2 49.17,23.77 v50.29,23.77 | SERVO2.2 16,45.72 17.22,46.94 22.86,46.94 24.08,45.72 SERVO1.2 24.18,45.82 25.3,46.94 27.23,46.94 28.45,45.72 ADDR_LED.1 | 40.64,15.75 5VBUS.7 5VBUS.5 5VBUS.3 5VBUS.1 | 40.64,15.75 40.64,19.71 36.88,23.47 IC1.4 | 40.64,15.75 33.73,15.75 33.33,16.15 31.8,16.15 D4.A 31.7,16.26 29.87,16.26 29.26,16.87 R9.2 29.16,16.87 28.55,16.26 25.4,16.26 D5.C 25.3,16.26 23.77,17.78 C8.A 21.74,17.88 20.73,18.9 20.73,20.42 18.69,22.45 v18.69,24.69
  Bottom 0.254: 50.29,23.37 50.29,17.07 48.26,15.04 5VBUS.1 | 50.29,23.37 v50.29,23.77 | v70.61,28.35 66.65,28.35 62.08,23.77 53.44,23.77 53.03,23.37 50.29,23.37 | v18.69,24.69 18.69,31.9 24.08,37.29 24.08,45.72 SERVO1.2
VDD
  Top 0.254: U4.3 39.52,37.08 41.35,37.08 41.96,37.69 43.08,37.69 43.89,36.88 R4.1

### Text on the board
tNames: ROBOT CONTROLLER SHEILD / © CHENGMING ZHANG / V0.1 FOR PURDUE UNIVERSITY
tValues: SERVO_2 | SERVO_1 | ADD_LED